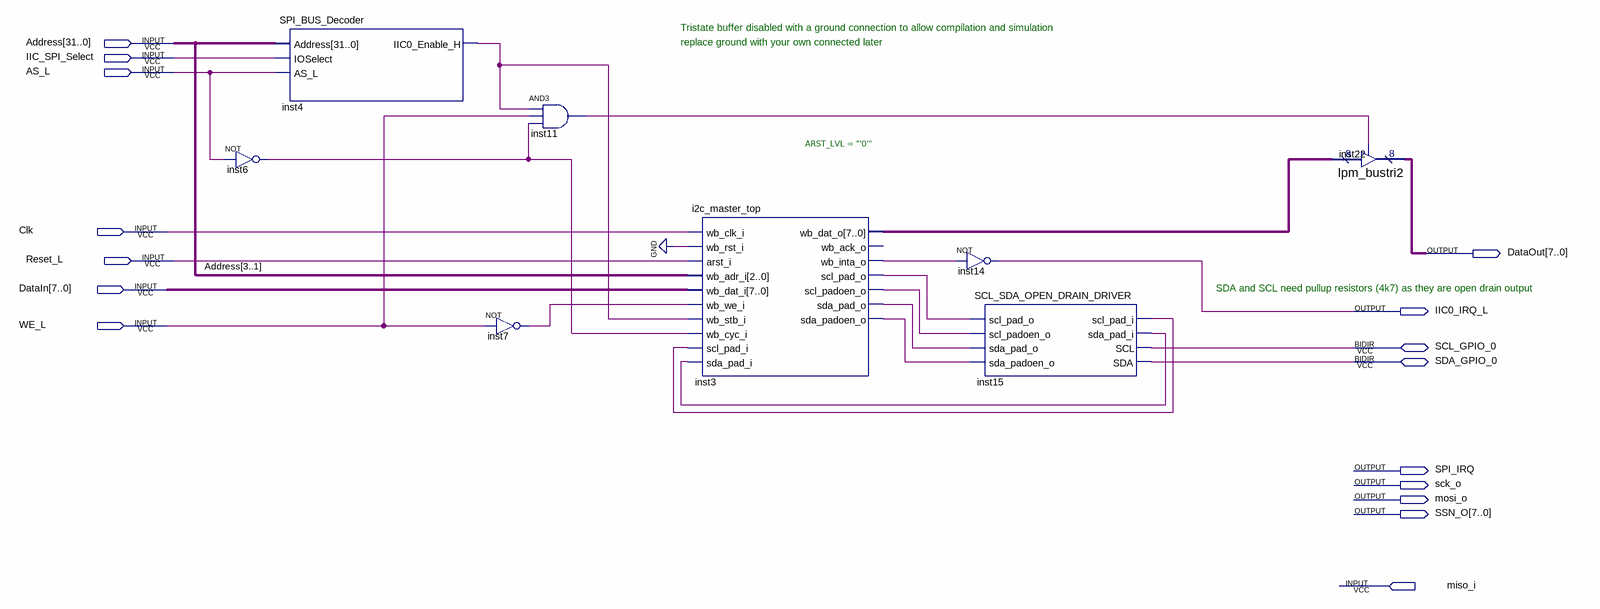
[diagram p0: schematic sheet]
// Quartus schematic IIC_SPI_Interface.bdf as structural Verilog: 8 symbols, 16 pins
module IIC_SPI_Interface (
  input  [31:0] Address,
  input  IIC_SPI_Select,
  input  AS_L,
  input  Clk,
  input  Reset_L,
  input  [7:0] DataIn,
  input  WE_L,
  input  miso_i,
  inout  SCL_GPIO_0,
  inout  SDA_GPIO_0,
  output [7:0] DataOut,
  output IIC0_IRQ_L,
  output SPI_IRQ,
  output sck_o,
  output mosi_o,
  output [7:0] SSN_O
);

  wire inst3_scl_pad_o, inst3_scl_padoen_o, inst3_sda_pad_o, inst3_sda_padoen_o, inst3_wb_inta_o,
       inst4_iic0_enable_h, inst6_out, inst7_out, inst11_out, inst15_scl_pad_i, inst15_sda_pad_i;
  wire [7:0] inst3_wb_dat_o;

  not inst6 (inst6_out, AS_L);
  SPI_BUS_Decoder inst4 (
    .Address(Address), .AS_L(AS_L), .IOSelect(IIC_SPI_Select), .IIC0_Enable_H(inst4_iic0_enable_h));
  and inst11 (inst11_out, inst4_iic0_enable_h, WE_L, inst6_out);
  not inst7 (inst7_out, WE_L);
  i2c_master_top #(.ARST_LVL("'0'")) inst3 (
    .wb_clk_i(Clk), .wb_rst_i(1'b0), .arst_i(Reset_L), .wb_adr_i(Address[3:1]), .wb_dat_i(DataIn),
    .wb_we_i(inst7_out), .wb_stb_i(inst4_iic0_enable_h), .wb_cyc_i(inst6_out), .scl_pad_i(inst15_scl_pad_i),
    .sda_pad_i(inst15_sda_pad_i), .wb_dat_o(inst3_wb_dat_o), .wb_inta_o(inst3_wb_inta_o),
    .scl_pad_o(inst3_scl_pad_o), .scl_padoen_o(inst3_scl_padoen_o), .sda_pad_o(inst3_sda_pad_o),
    .sda_padoen_o(inst3_sda_padoen_o));  // open: wb_ack_o
  not inst14 (IIC0_IRQ_L, inst3_wb_inta_o);
  SCL_SDA_OPEN_DRAIN_DRIVER inst15 (
    .scl_pad_o(inst3_scl_pad_o), .scl_padoen_o(inst3_scl_padoen_o), .sda_pad_o(inst3_sda_pad_o),
    .sda_padoen_o(inst3_sda_padoen_o), .scl_pad_i(inst15_scl_pad_i), .sda_pad_i(inst15_sda_pad_i),
    .SCL(SCL_GPIO_0), .SDA(SDA_GPIO_0));
  lpm_bustri2 inst22 (.enabledt(inst11_out), .data(inst3_wb_dat_o), .tridata(DataOut));

  // Notes on the sheet:
  //   Tristate buffer disabled with a ground connection to allow compilation and simulation
  //   replace ground with your own connected later
  //   SDA and SCL need pullup resistors (4k7) as they are open drain output
endmodule
